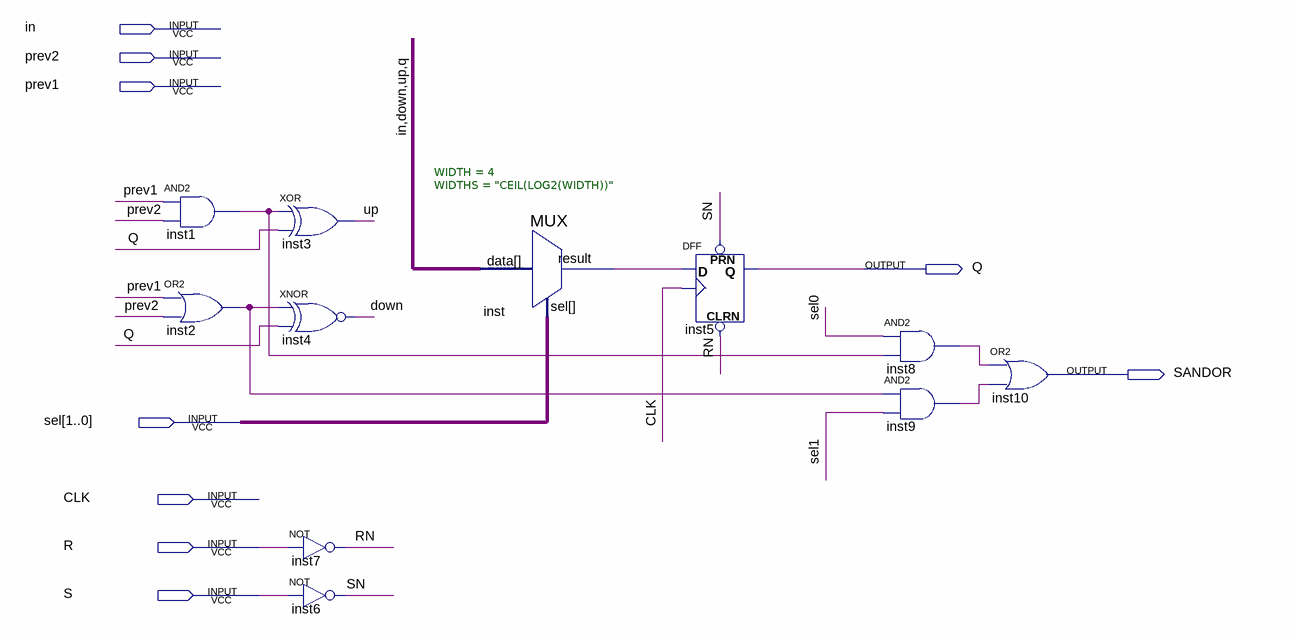
[diagram p0: schematic sheet]
// Quartus schematic contador.bdf as structural Verilog: 11 symbols, 9 pins
module contador (
  input  in,
  input  prev2,
  input  prev1,
  input  [1:0] sel,
  input  CLK,
  input  R,
  input  S,
  output Q,
  output SANDOR
);

  wire down, inst1_out, inst2_out, inst8_out, inst9_out, inst_result, RN, SN, up;

  and inst1 (inst1_out, prev1, prev2);
  or inst2 (inst2_out, prev1, prev2);
  xor inst3 (up, inst1_out, Q);
  xnor inst4 (down, inst2_out, Q);
  not inst7 (RN, R);
  not inst6 (SN, S);
  MUX #(.WIDTH(4), .WIDTHS("CEIL(LOG2(WIDTH))")) inst (.data({in, down, up, Q}), .sel(sel), .result(inst_result));
  DFF inst5 (.CLRN(RN), .CLK(CLK), .D(inst_result), .PRN(SN), .Q(Q));
  and inst8 (inst8_out, sel[0], inst1_out);
  and inst9 (inst9_out, inst2_out, sel[1]);
  or inst10 (SANDOR, inst8_out, inst9_out);
endmodule
